# Altium project basestation_0v1.PrjPCB
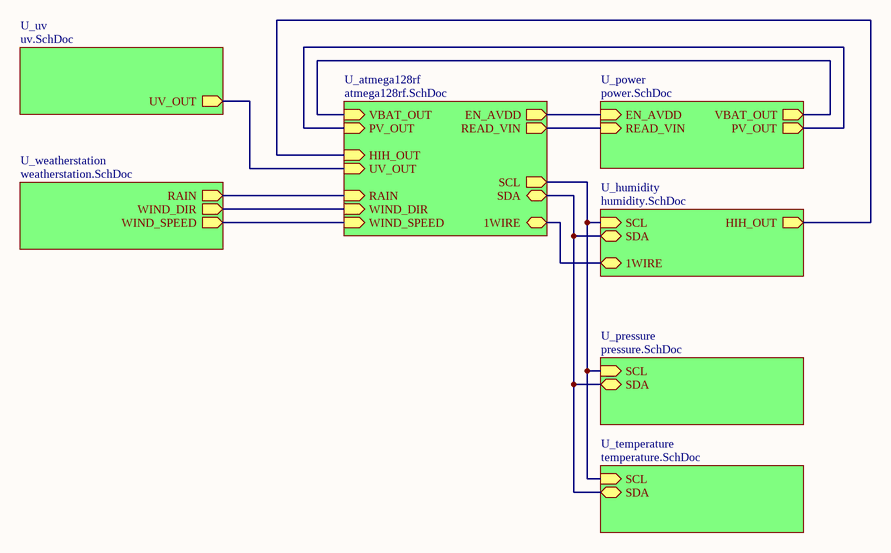
[diagram p0: main.SchDoc]
8 sheets, 134 parts. Net scope: hierarchical (ports join the sheet entries above them; power ports are global).
Board file: basestation_0v1.PcbDoc
Sheets:
  main.SchDoc
    U_atmega128rf = atmega128rf.SchDoc
    U_humidity = humidity.SchDoc
    U_power = power.SchDoc
    U_pressure = pressure.SchDoc
    U_temperature = temperature.SchDoc
    U_uv = uv.SchDoc
    U_weatherstation = weatherstation.SchDoc

## Sheet main.SchDoc: Main
size A4; CheckedBy: rrodrigu; Author: Satxo; CompanyName: Satxo; Revision: 0v1; SheetNumber: 1; SheetTotal: 8; ProjectName: Basestation

### Sub-sheets
U_atmega128rf = atmega128rf.SchDoc: SCL (out), SDA (bidir), HIH_OUT (in), PV_OUT (in), UV_OUT (in), VBAT_OUT (in), RAIN (in), WIND_DIR (in), WIND_SPEED (in), EN_AVDD (out), READ_VIN (out), 1WIRE (bidir)
U_humidity = humidity.SchDoc: HIH_OUT (out), SCL (in), SDA (bidir), 1WIRE (bidir)
U_power = power.SchDoc: PV_OUT (out), EN_AVDD (in), VBAT_OUT (out), READ_VIN (in)
U_pressure = pressure.SchDoc: SCL (in), SDA (bidir)
U_temperature = temperature.SchDoc: SCL (in), SDA (bidir)
U_uv = uv.SchDoc: UV_OUT (out)
U_weatherstation = weatherstation.SchDoc: RAIN (out), WIND_DIR (out), WIND_SPEED (out)

### Nets
1WIRE: sheet U_atmega128rf/1WIRE, sheet U_humidity/1WIRE
EN_AVDD: sheet U_atmega128rf/EN_AVDD, sheet U_power/EN_AVDD
HIH_OUT: sheet U_atmega128rf/HIH_OUT, sheet U_humidity/HIH_OUT
PV_OUT: sheet U_atmega128rf/PV_OUT, sheet U_power/PV_OUT
RAIN: sheet U_atmega128rf/RAIN, sheet U_weatherstation/RAIN
READ_VIN: sheet U_atmega128rf/READ_VIN, sheet U_power/READ_VIN
SCL: sheet U_atmega128rf/SCL, sheet U_humidity/SCL, sheet U_pressure/SCL, sheet U_temperature/SCL
SDA: sheet U_atmega128rf/SDA, sheet U_humidity/SDA, sheet U_pressure/SDA, sheet U_temperature/SDA
UV_OUT: sheet U_atmega128rf/UV_OUT, sheet U_uv/UV_OUT
VBAT_OUT: sheet U_atmega128rf/VBAT_OUT, sheet U_power/VBAT_OUT
WIND_DIR: sheet U_atmega128rf/WIND_DIR, sheet U_weatherstation/WIND_DIR
WIND_SPEED: sheet U_atmega128rf/WIND_SPEED, sheet U_weatherstation/WIND_SPEED

### Notes on the sheet
- Title
- Size:
- Date:
- A4
- Number:
- Time:
- Revision:
- Sheet
- of
- File:

## Sheet atmega128rf.SchDoc: Microcontroller
size A3; CheckedBy: rrodrigu; Author: Satxo; CompanyName: Satxo; Revision: 0v1; SheetNumber: 3; SheetTotal: 8; ProjectName: Basesation
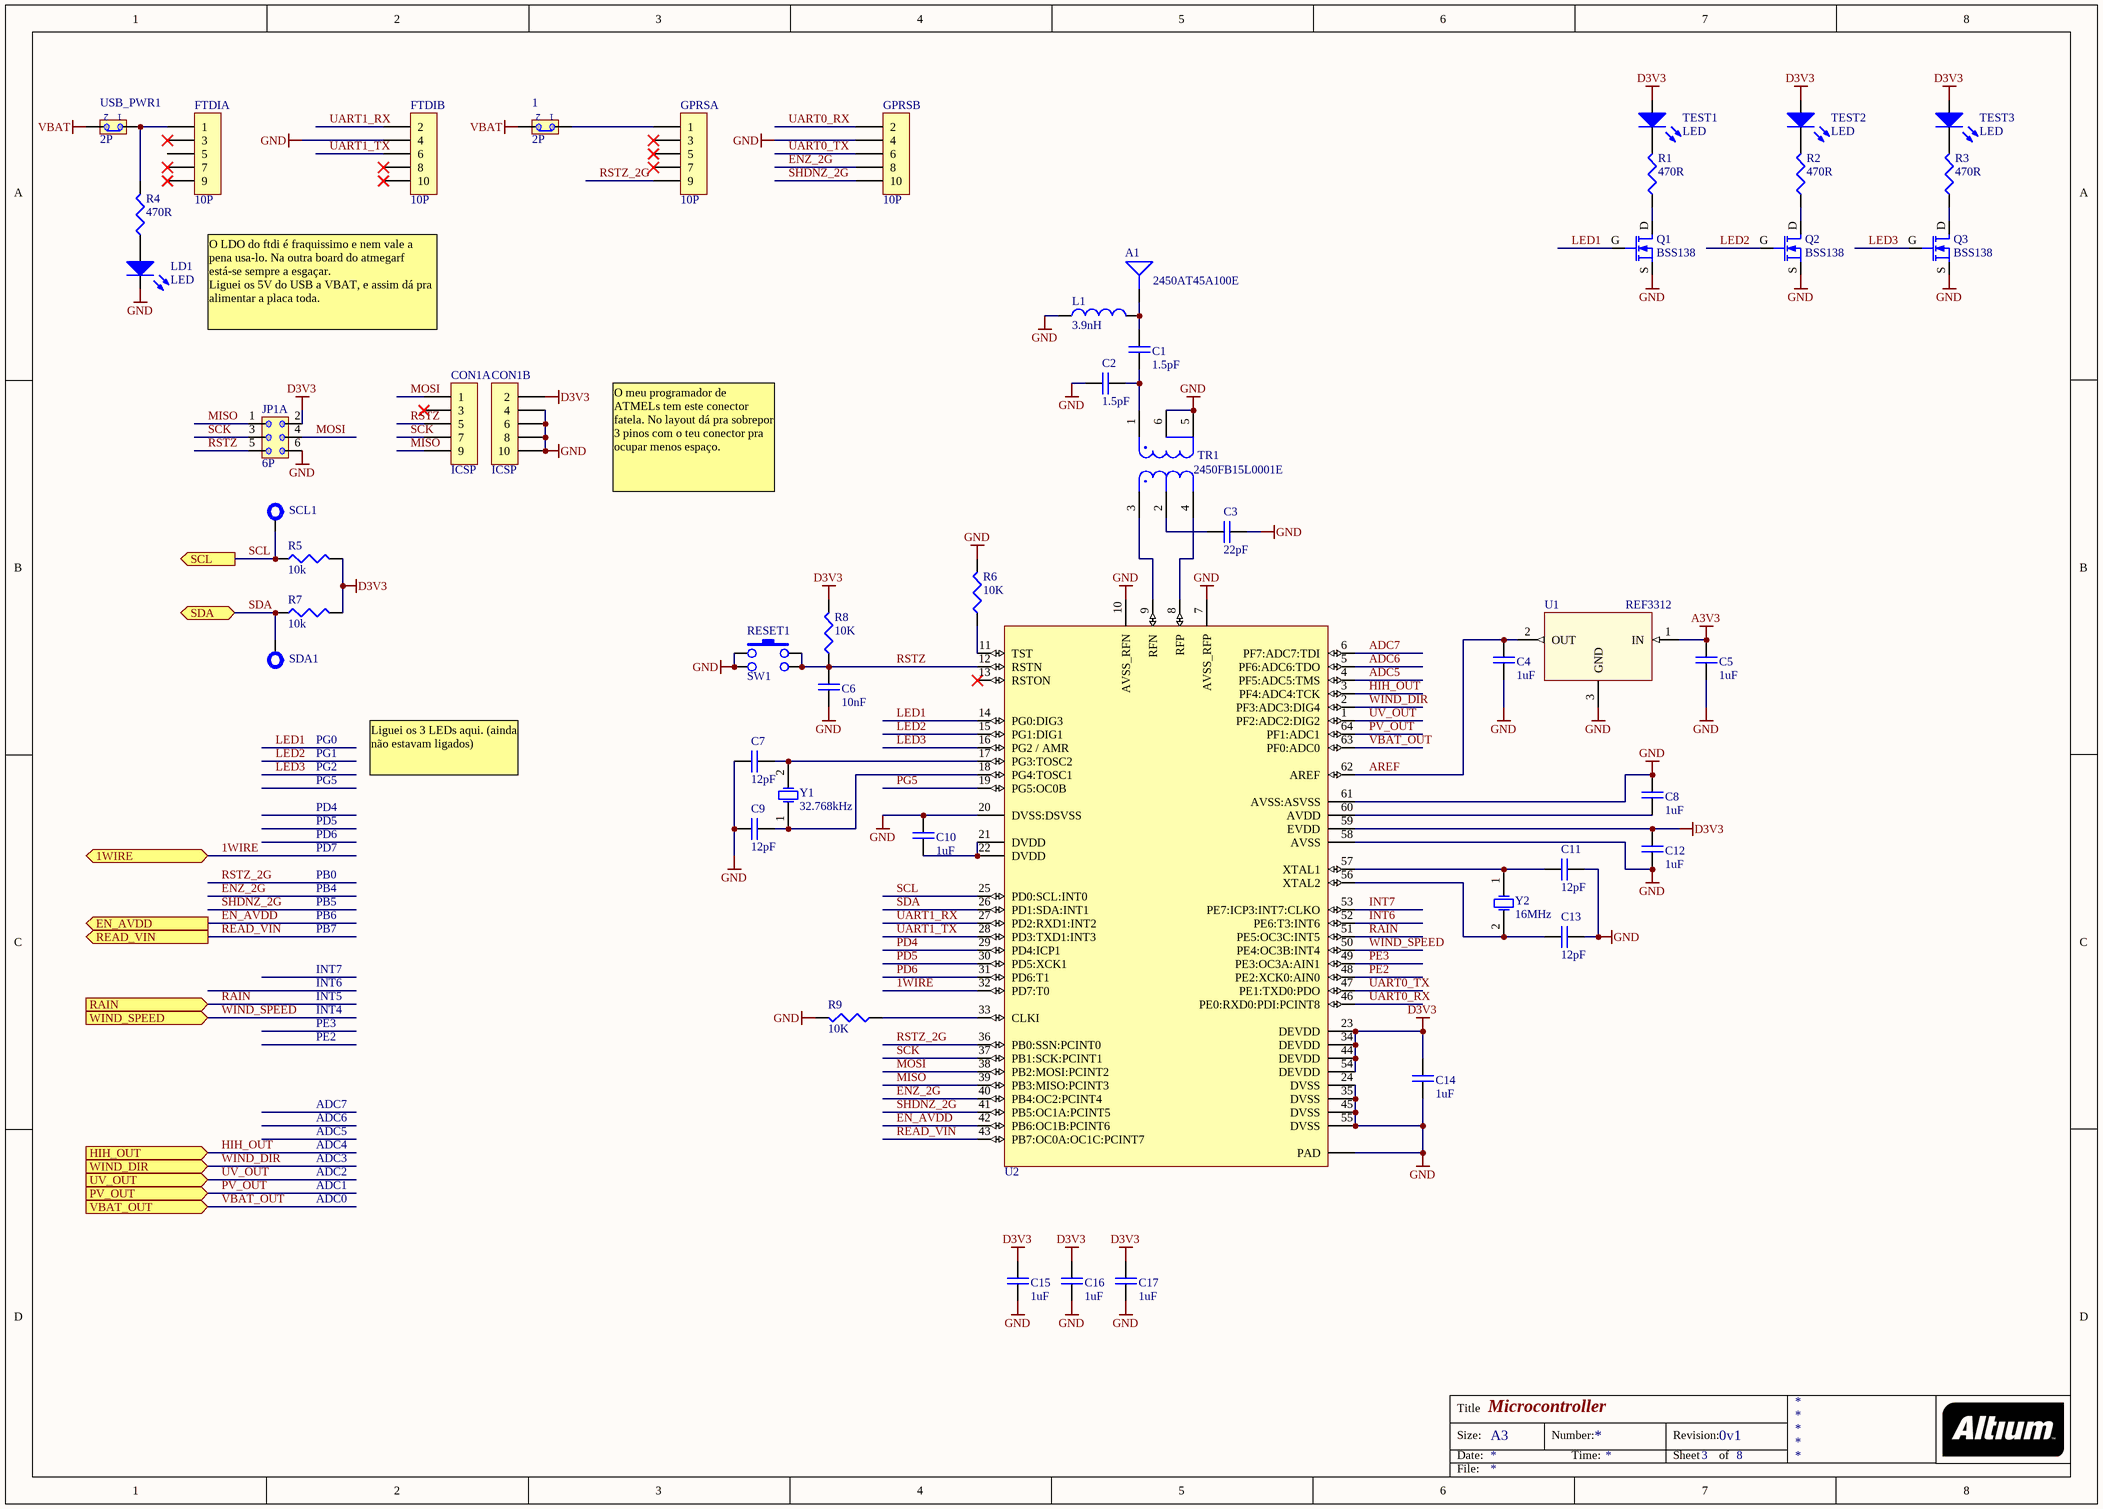
[diagram p1: atmega128rf.SchDoc]

### Parts
(Parts that share a designator on the sheet are numbered #1, #2 ... from top to bottom, then left to right.)
1  2P  [SIP-2]
A1  2450AT45A100E  [2450AT45A100E]
C1#1  1.5pF  [0402]
C2#1  1.5pF  [0402]
C3#1  22pF  [0402]
C4#1  1uF  [0603]
C5#1  1uF  [0603]
C6#1  10nF  [0603]
C7#1  12pF  [0603]
C8#1  1uF  [0603]
C9#1  12pF  [0603]
C10  1uF  [0603]
C11  12pF  [0603]
C12  1uF  [0603]
C13  12pF  [0603]
C14  1uF  [0603]
C15  1uF  [0603]
C16  1uF  [0603]
C17  1uF  [0603]
CON1#1  ICSP  [IDC-10-F]  (parts A,B of 2)
FTDI  10P  [IDC-10-90]  (parts A,B of 2)
GPRS  10P  [IDC-10-90]  (parts A,B of 2)
JP1#1  6P  [DIL-6]  (part A of 3)
L1  3.9nH  [0402]
LD1  LED  [0805@DIODE]
Q1#1  BSS138  [SOT-23@GSD]
Q2#1  BSS138  [SOT-23@GSD]
Q3  BSS138  [SOT-23@GSD]
R1#1  470R  [0603]
R2#1  470R  [0603]
R3#1  470R  [0603]
R4#1  470R  [0603]
R5#1  10k  [0603]
R6#1  10K  [0603]
R7#1  10k  [0603]
R8#1  10K  [0603]
R9#1  10K  [0603]
RESET1  SW1  [MICROSWITCH]
SCL1  Test Point  [TERMINAL]  (value not drawn)  (no BOM)
SDA1  Test Point  [TERMINAL]  (value not drawn)  (no BOM)
TEST1  LED  [0805@DIODE]
TEST2  LED  [0805@DIODE]
TEST3  LED  [0805@DIODE]
TR1  2450FB15L0001E  [0805@BALUN]
U1#1  REF3312  [SOT-23]
U2#1  ATmega128RFA1  [QFN-64@EP]  (value not drawn)
USB_PWR1  2P  [SIP-2]
Y1  32.768kHz  [HC-49U]
Y2  16MHz  [HC-49U]

### Ports
1WIRE (bidir), EN_AVDD (out), HIH_OUT (in), PV_OUT (in), RAIN (in), READ_VIN (out), SCL (out), SDA (bidir), UV_OUT (in), VBAT_OUT (in), WIND_DIR (in), WIND_SPEED (in)

### Nets
A3V3: C5#1.1 U1#1.1(IN)
D3V3: C12.2 C14.2 C15.2 C16.2 C17.2 CON1#1.2 JP1#1.2 R5#1.2 R7#1.2 R8#1.2 TEST1.A TEST2.A TEST3.A U2#1.23(DEVDD) U2#1.34(DEVDD) U2#1.44(DEVDD) U2#1.54(DEVDD) U2#1.59(EVDD)
GND: C2#1.1 C3#1.2 C4#1.2 C5#1.2 C6#1.2 C7#1.1 C8#1.2 C9#1.1 C10.2 C11.2 C12.1 C13.2 C14.1 C15.1 C16.1 C17.1 CON1#1.4 CON1#1.6 CON1#1.8 CON1#1.10 FTDI.4 GPRS.4 JP1#1.6 L1.1 LD1.K Q1#1.S Q2#1.S Q3.S R6#1.2 R9#1.2 RESET1.1 RESET1.3 TR1.5(Ground) TR1.6(Ground) U1#1.3(GND) U2#1.7(AVSS_RFP) U2#1.10(AVSS_RFN) U2#1.20(DVSS:DSVSS) U2#1.24(DVSS) U2#1.35(DVSS) U2#1.45(DVSS) U2#1.55(DVSS) U2#1.58(AVSS) U2#1.61(AVSS:ASVSS) U2#1.PAD
VBAT: 1.2 USB_PWR1.2
1WIRE: U2#1.32(PD7:T0) ; port 1WIRE
ADC5: U2#1.4(PF5:ADC5:TMS)
ADC6: U2#1.5(PF6:ADC6:TDO)
ADC7: U2#1.6(PF7:ADC7:TDI)
AREF: C4#1.1 U1#1.2(OUT) U2#1.62(AREF)
EN_AVDD: U2#1.42(PB6:OC1B:PCINT6) ; port EN_AVDD
ENZ_2G: GPRS.8 U2#1.40(PB4:OC2:PCINT4)
HIH_OUT: U2#1.3(PF4:ADC4:TCK) ; port HIH_OUT
INT6: U2#1.52(PE6:T3:INT6)
INT7: U2#1.53(PE7:ICP3:INT7:CLKO)
LED1: Q1#1.G U2#1.14(PG0:DIG3)
LED2: Q2#1.G U2#1.15(PG1:DIG1)
LED3: Q3.G U2#1.16(PG2_/_AMR)
MISO: CON1#1.9 JP1#1.1 U2#1.39(PB3:MISO:PCINT3)
MOSI: CON1#1.1 JP1#1.4 U2#1.38(PB2:MOSI:PCINT2)
PD4: U2#1.29(PD4:ICP1)
PD5: U2#1.30(PD5:XCK1)
PD6: U2#1.31(PD6:T1)
PE2: U2#1.48(PE2:XCK0:AIN0)
PE3: U2#1.49(PE3:OC3A:AIN1)
PG5: U2#1.19(PG5:OC0B)
PV_OUT: U2#1.64(PF1:ADC1) ; port PV_OUT
RAIN: U2#1.51(PE5:OC3C:INT5) ; port RAIN
READ_VIN: U2#1.43(PB7:OC0A:OC1C:PCINT7) ; port READ_VIN
RSTZ: C6#1.1 CON1#1.5 JP1#1.5 R8#1.1 RESET1.2 RESET1.4 U2#1.12(RSTN)
RSTZ_2G: GPRS.9 U2#1.36(PB0:SSN:PCINT0)
SCK: CON1#1.7 JP1#1.3 U2#1.37(PB1:SCK:PCINT1)
SCL: R5#1.1 SCL1.1(TP) U2#1.25(PD0:SCL:INT0) ; port SCL
SDA: R7#1.1 SDA1.1(TP) U2#1.26(PD1:SDA:INT1) ; port SDA
SHDNZ_2G: GPRS.10 U2#1.41(PB5:OC1A:PCINT5)
UART0_RX: GPRS.2 U2#1.46(PE0:RXD0:PDI:PCINT8)
UART0_TX: GPRS.6 U2#1.47(PE1:TXD0:PDO)
UART1_RX: FTDI.2 U2#1.27(PD2:RXD1:INT2)
UART1_TX: FTDI.6 U2#1.28(PD3:TXD1:INT3)
UV_OUT: U2#1.1(PF2:ADC2:DIG2) ; port UV_OUT
VBAT_OUT: U2#1.63(PF0:ADC0) ; port VBAT_OUT
WIND_DIR: U2#1.2(PF3:ADC3:DIG4) ; port WIND_DIR
WIND_SPEED: U2#1.50(PE4:OC3B:INT4) ; port WIND_SPEED
Net1_1: 1.1 GPRS.1
NetA1_1: A1.1 C1#1.2 L1.2
NetC1#1_1: C1#1.1 C2#1.2 TR1.1(Unbalanced_Port)
NetC3#1_1: C3#1.1 TR1.2(DC_Feed_+_RF_GND)
NetC7#1_2: C7#1.2 U2#1.17(PG3:TOSC2) Y1.2(OSC2)
NetC8#1_1: C8#1.1 U2#1.60(AVDD)
NetC9#1_2: C9#1.2 U2#1.18(PG4:TOSC1) Y1.1(OSC1)
NetC10_1: C10.1 U2#1.21(DVDD) U2#1.22(DVDD)
NetC11_1: C11.1 U2#1.57(XTAL1) Y2.1(OSC1)
NetC13_1: C13.1 U2#1.56(XTAL2) Y2.2(OSC2)
NetFTDI_1: FTDI.1 R4#1.2 USB_PWR1.1
NetLD1_A: LD1.A R4#1.1
NetQ1#1_D: Q1#1.D R1#1.1
NetQ2#1_D: Q2#1.D R2#1.1
NetQ3_D: Q3.D R3#1.1
NetR1#1_2: R1#1.2 TEST1.K
NetR2#1_2: R2#1.2 TEST2.K
NetR3#1_2: R3#1.2 TEST3.K
NetR6#1_1: R6#1.1 U2#1.11(TST)
NetR9#1_1: R9#1.1 U2#1.33(CLKI)
NetTR1_3: TR1.3(Balanced_Port) U2#1.9(RFN)
NetTR1_4: TR1.4(Balanced_Port) U2#1.8(RFP)

Not connected (* = marked no-connect by the designer): CON1#1 3*; FTDI 3* 5 7* 8* 9* 10*; GPRS 3* 5* 7*; U2#1 13(RSTON)*

### Notes on the sheet
- O LDO do ftdi é fraquissimo e nem vale a pena usa-lo. Na outra board do atmegarf está-se sempre a esgaçar.
  Liguei os 5V do USB a VBAT, e assim dá pra alimentar a placa toda.
- O meu programador de ATMELs tem este conector fatela. No layout dá pra sobrepor 3 pinos com o teu conector pra ocupar menos espaço.
- PG0
- PG1
- PG2
- PG5
- Liguei os 3 LEDs aqui. (ainda não estavam ligados)
- PD4
- PD5
- PD6
- PD7
- PB0
- PB4
- PB5
- PB6
- INT6
- INT7
- PB7
- PE2
- PE3
- INT4
- INT5
- ADC6
- ADC7
- ADC1
- ADC2
- ADC3
- ADC4
- ADC5
- ADC0
- Title
- Size:
- Date:
- A3
- Number:
- Time:
- Revision:
- Sheet
- of
- File:

### Library data of the parts
1 USB_PWR1 = JMP2: 2-pin Jumper; Owner: Nuno Brum; Sub-Type: Connector; STATE1: 1; Assembly: INS; Validation Date: 2006-05-15; Creation Date: 2002-07-17; Status: Valid; Type: Electrical & Mechanical
A1 = Antenna SE: ANTENNA
C1#1 C2#1 C3#1 C4#1 C5#1 C6#1 C7#1 C8#1 C9#1 C10-C17 = CAP: Capacitor; Owner: Nuno Brum; Sub-Type: Ceramic; Assembly: INS; Maximum Voltage: *; Creation Date: 2005-04-28; Status: Valid; Validation date: 2006-05-15; Type: Capacitor
CON1#1 FTDI GPRS = CON10: Connector 10 Pins; Owner: António Silva; Assembly: INS; Sub-Type: Connector; Creation Date: 2005-11-21; Status: Valid; Validation Date: 2006-05-15; Type: Electrical & Mechanical
JP1#1 = JMP6: 6-Pin Jumper; Sub-Type: Connector; Owner: Rui Rebelo; Assembly: INS; Creation Date: 2005-07-17; Status: Valid; Validation Date: 2006-05-15; Type: Electrical & Mechanical
L1 = IND: Inductor; Owner: Nuno Brum; Sub-Type: Generic; Assembly: INS; Validation date: 2006-05-15; Creation Date: 2002-07-17; Status: Valid; Type: Inductor
LD1 TEST1-TEST3 = LED: Light emitting diode; Owner: Nuno Brum; Assembly: INS; Creation Date: 2001-06-05; Sub-Type: LED; Status: Valid; Validation date: 2006-05-15; Model: LED; Type: Diode
Q1#1 Q2#1 Q3 = MOSFET-N: N-Channel Logic Level Enhancement Mode Field Effect Transistor; pin to pad: 2>3 3>2; Owner: Nuno Brum; Sub-Type: MOSFET; Assembly: INS; Creation Date: 2001-06-05; Status: Valid; Model: BSS138; Type: Transistor
R1#1 R2#1 R3#1 R4#1 R5#1 R6#1 R7#1 R8#1 R9#1 = RES: Resistor; Owner: Nuno Brum; Sub-Type: Generic; Assembly: INS; Validation date: 2006-05-15; Creation Date: 2002-07-17; Status: Valid; Power: *; Type: Resistor
RESET1 = SW1: Switch Push Button; Owner: Nuno Brum; Assembly: INS; Validation Date: 2006-05-15; Sub-Type: Switch; Creation Date: 2002-07-17; Status: Valid; Type: Electrical & Mechanical
SCL1 SDA1 = TEST-PROBE: Test/Probe Point; Owner: Nuno Brum; Sub-Type: Mechanical; Assembly: PCB; Validation Date: 2006-05-15; Type: PCB; Creation Date: 2005-06-01; Status: Valid
TR1 = 2450FB15L0001E: FILTER BALUN ATMEL 2.45GHZ; Owner: Rui Rebelo; Sub-Type: Transformer; Type: Electrical & Mechanical; Assembly: INS; Creation Date: 2002-07-25; Status: New
U1#1 = REF3312: Voltage Reference 1.25V, 30ppm/degC, 5mA; Type: IC; Creation Date: 2012-12-09
U2#1 = ATmega128RFA1: 802.15.4 compliant AVR transceiver; verified by: vlarsen; verified date: 2010-12-05; Status: Verified
Y1 Y2 = Crystal Oscillator: Published: 17-Jul-2002; DatasheetDocument: 18-Apr-2000; PackageReference: CSM-7; Publisher: Altium Limited; ComponentLink1Description: Manufacturer Link; ComponentLink1URL: http://www.ecsxtal.com/; ComponentLink2Description: Datasheet; ComponentLink2URL: http://www.ecsxtal.com/pdf3/CSM_7.pdf

## Sheet humidity.SchDoc
size A4
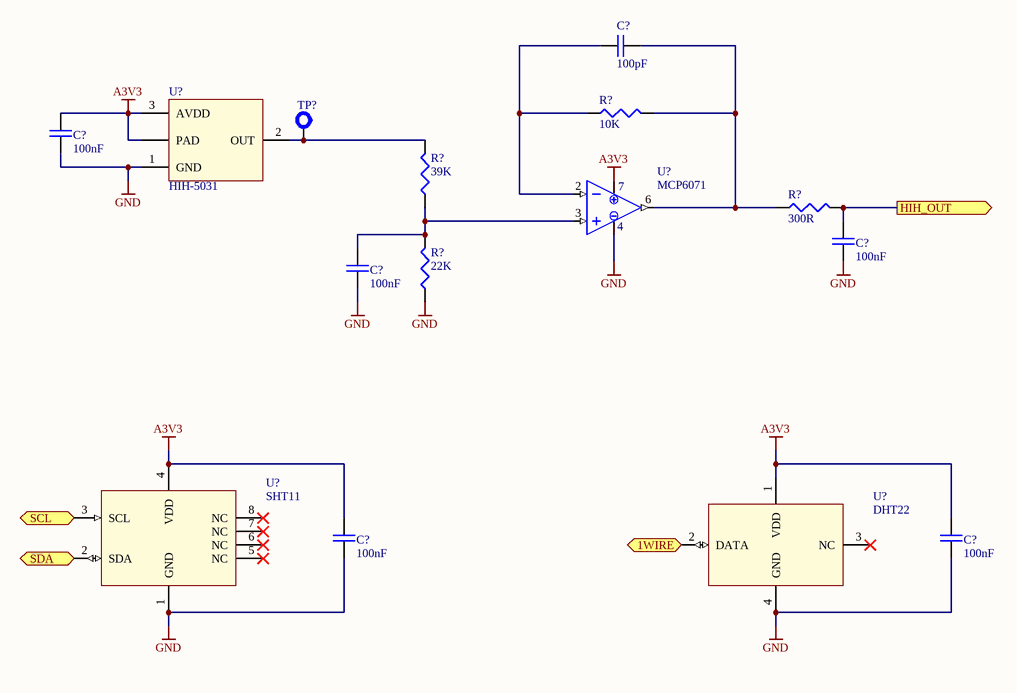
[diagram p2: humidity.SchDoc]

### Parts
C27  100pF  [0603]
C28  100nF  [0603]
C29  100nF  [0603]
C30  100nF  [0603]
C31  100nF  [0603]
C32  100nF  [0603]
R22  10K  [0603]
R24  39K  [0603]
R25  300R  [0603]
R26  22K  [0603]
TP1  Test Point  [TERMINAL]  (value not drawn)  (no BOM)
U7  HIH-5031  [HIH]
U8  MCP6071  [SOIC-8]
U10  DHT22  [DHT22]
U?  SHT11  [SHT11]

### Ports
1WIRE (bidir), HIH_OUT (out), SCL (in), SDA (bidir)

### Nets
A3V3: C28.2 C31.2 C32.2 U7.3(AVDD) U7.PAD U8.7(VDD) U10.1(VDD) U?.4(VDD)
GND: C28.1 C29.1 C30.1 C31.1 C32.1 R26.1 U7.1(GND) U8.4(VSS) U10.4(GND) U?.1(GND)
1WIRE: U10.2(DATA) ; port 1WIRE
HIH_OUT: C29.2 R25.2 ; port HIH_OUT
SCL: U?.3(SCL) ; port SCL
SDA: U?.2(SDA) ; port SDA
NetC27_1: C27.1 R22.1 U8.2(INN)
NetC27_2: C27.2 R22.2 R25.1 U8.6(VOUT)
NetC30_2: C30.2 R24.1 R26.2 U8.3(INP)
NetR24_2: R24.2 TP1.1(TP) U7.2(OUT)

Not connected (* = marked no-connect by the designer): U10 3(NC)*; U? 5(NC)* 6(NC)* 7(NC)* 8(NC)*

### Notes on the sheet
- Title
- Size:
- Date:
- A4
- Number:
- Time:
- Revision:
- Sheet
- of
- File:

### Library data of the parts
C27-C32 = CAP: as C1#1 on sheet atmega128rf; Maximum Voltage: *; Creation Date: 2005-04-28; Status: Valid; Validation date: 2006-05-15; Type: Capacitor
R22 R24-R26 = RES: as R1#1 on sheet atmega128rf; Validation date: 2006-05-15; Creation Date: 2002-07-17; Status: Valid; Power: *; Type: Resistor
TP1 = TEST-PROBE: as SCL1 on sheet atmega128rf; Validation Date: 2006-05-15; Type: PCB; Creation Date: 2005-06-01; Status: Valid
U7 = HIH-5031: Low Voltage Humidity Sensor; Type: IC; Creation Date: 2012-03-05
U8 = MCP6V26: Low-Offset Opamp; Type: IC; Creation Date: 2012-03-15
U10 = DHT22: Digital Humidity and Temperature Sensor; Type: IC; Creation Date: 2012-12-08
U? = SHT11: Digital Humidity and Temperature Sensor; Type: IC; Creation Date: 2012-12-09

## Sheet power.SchDoc: Power
size A4; CheckedBy: rrodrigu; Author: Satxo; CompanyName: Satxo; Revision: 0v1; SheetNumber: 2; SheetTotal: 8; ProjectName: Basestation
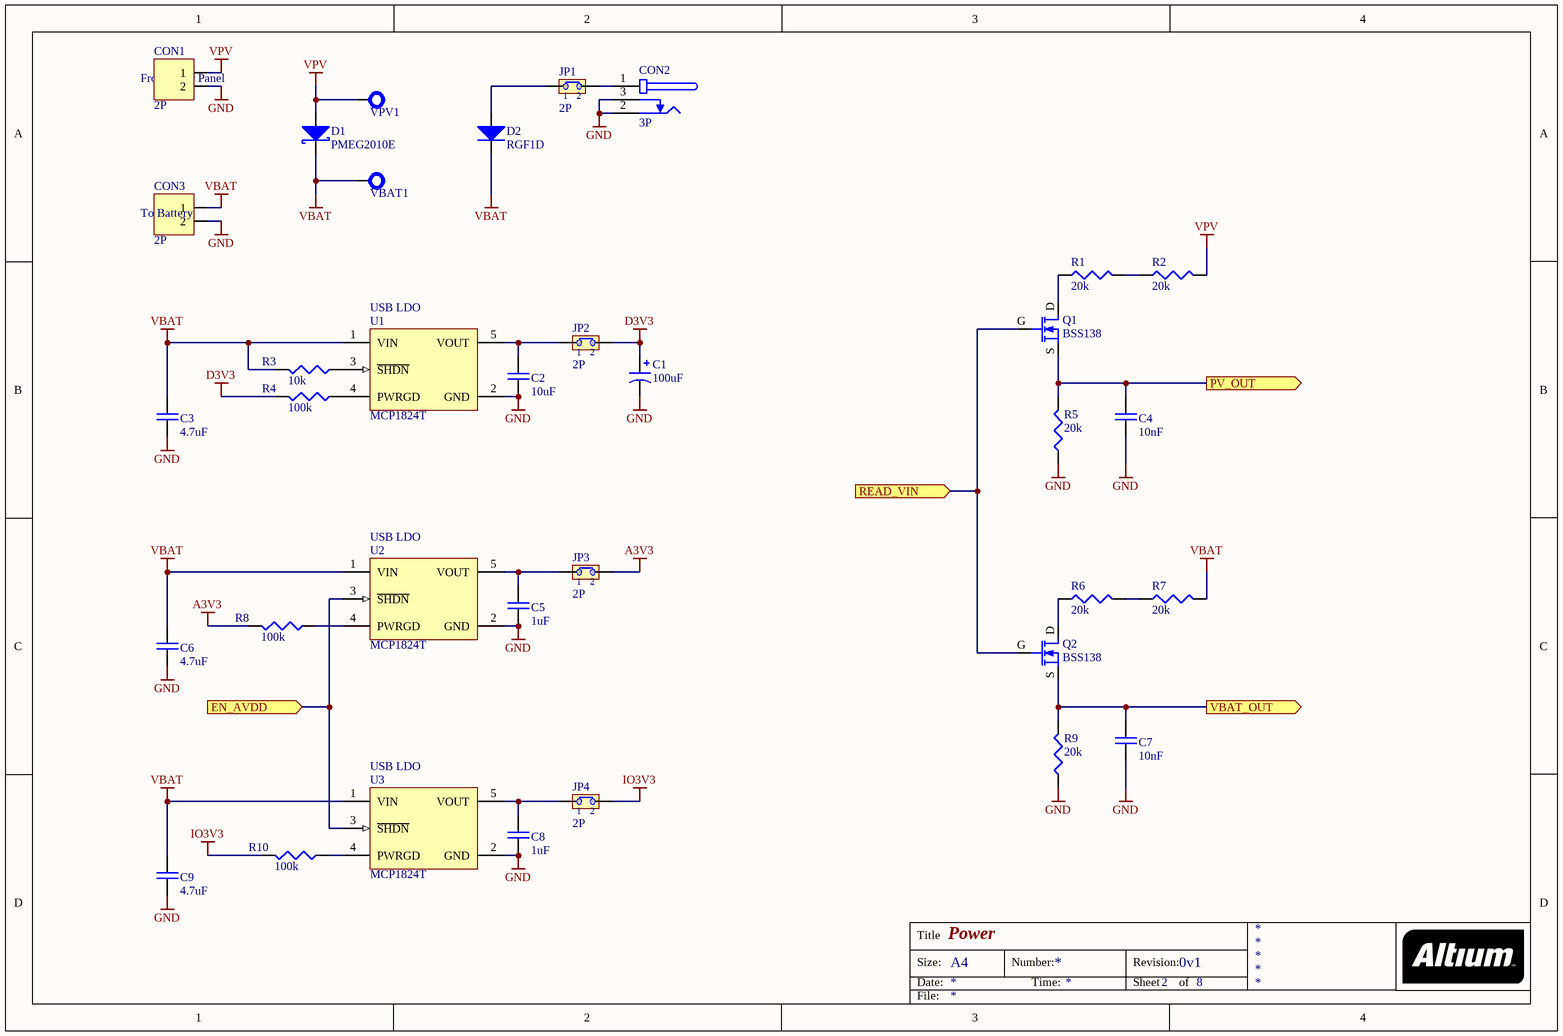
[diagram p3: power.SchDoc]

### Parts
(Parts that share a designator on the sheet are numbered #1, #2 ... from top to bottom, then left to right.)
C1#2  100uF  [RADIAL-2.5MM]
C2#2  10uF  [0805]
C3#2  4.7uF  [0805]
C4#2  10nF  [0603]
C5#2  1uF  [0805]
C6#2  4.7uF  [0805]
C7#2  10nF  [0603]
C8#2  1uF  [0805]
C9#2  4.7uF  [0805]
CON1#2  2P  [JST-2MM]
CON2  3P  [JACKPOW/PD-2.5MM-TH]
CON3  2P  [INTERLOCK2-5MM-FIXED]
D1  PMEG2010E  [SOD-123]
D2#1  RGF1D  [DO-214BA]
JP1#2  2P  [SIP-2]
JP2  2P  [SIP-2]
JP3  2P  [SIP-2]
JP4  2P  [SIP-2]
Q1#2  BSS138  [SOT-23@GSD]
Q2#2  BSS138  [SOT-23@GSD]
R1#2  20k  [0603]
R2#2  20k  [0603]
R3#2  10k  [0603]
R4#2  100k  [0603]
R5#2  20k  [0603]
R6#2  20k  [0603]
R7#2  20k  [0603]
R8#2  100k  [0603]
R9#2  20k  [0603]
R10  100k  [0603]
U1#2  MCP1824T  [SOT-23-5]
U2#2  MCP1824T  [SOT-23-5]
U3  MCP1824T  [SOT-23-5]
VBAT1  Test Point  [TERMINAL]  (value not drawn)  (no BOM)
VPV1  Test Point  [TERMINAL]  (value not drawn)  (no BOM)

### Ports
EN_AVDD (in), PV_OUT (out), READ_VIN (in), VBAT_OUT (out)

### Nets
A3V3: JP3.2 R8#2.2
D3V3: C1#2.1(P) JP2.2 R4#2.2
GND: C1#2.2(N) C2#2.1 C3#2.1 C4#2.1 C5#2.1 C6#2.1 C7#2.1 C8#2.1 C9#2.1 CON1#2.2 CON2.2 CON2.3 CON3.2 R5#2.1 R9#2.1 U1#2.2(GND) U2#2.2(GND) U3.2(GND)
IO3V3: JP4.2 R10.2
VBAT: C3#2.2 C6#2.2 C9#2.2 CON3.1 D1.K D2#1.K R3#2.2 R7#2.2 U1#2.1(VIN) U2#2.1(VIN) U3.1(VIN) VBAT1.1(TP)
VPV: CON1#2.1 D1.A R2#2.2 VPV1.1(TP)
EN_AVDD: U2#2.3(~{SHDN}) U3.3(~{SHDN}) ; port EN_AVDD
PV_OUT: C4#2.2 Q1#2.S R5#2.2 ; port PV_OUT
READ_VIN: Q1#2.G Q2#2.G ; port READ_VIN
VBAT_OUT: C7#2.2 Q2#2.S R9#2.2 ; port VBAT_OUT
NetC2#2_2: C2#2.2 JP2.1 U1#2.5(VOUT)
NetC5#2_2: C5#2.2 JP3.1 U2#2.5(VOUT)
NetC8#2_2: C8#2.2 JP4.1 U3.5(VOUT)
NetCON2_1: CON2.1 JP1#2.2
NetD2#1_A: D2#1.A JP1#2.1
NetQ1#2_D: Q1#2.D R1#2.1
NetQ2#2_D: Q2#2.D R6#2.1
NetR1#2_2: R1#2.2 R2#2.1
NetR3#2_1: R3#2.1 U1#2.3(~{SHDN})
NetR4#2_1: R4#2.1 U1#2.4(PWRGD)
NetR6#2_2: R6#2.2 R7#2.1
NetR8#2_1: R8#2.1 U2#2.4(PWRGD)
NetR10_1: R10.1 U3.4(PWRGD)

### Notes on the sheet
- From Solar Panel
- To Battery
- (near U1#2) USB LDO
- (near U2#2) USB LDO
- (near U3) USB LDO
- Title
- Size:
- Date:
- A4
- Number:
- Time:
- Revision:
- Sheet
- of
- File:

### Library data of the parts
C1#2 = CAP POL: Polarized Capacitor; Owner: Nuno Brum; Sub-Type: Tantalum; Assembly: INS; Validation date: 2006-05-15; Creation Date: 2005-04-28; Status: Valid; Type: Capacitor
C2#2 C3#2 C4#2 C5#2 C6#2 C7#2 C8#2 C9#2 = CAP: as C1#1 on sheet atmega128rf; Maximum Voltage: *; Creation Date: 2005-04-28; Status: Valid; Validation date: 2006-05-15; Type: Capacitor
CON1#2 CON3 = CON02: Connector 2 pins; Owner: Rui Rebelo; Assembly: INS; Sub-Type: Connector; Creation Date: 2005-05-27; Status: Valid; Validation Date: 2006-05-15; Type: Electrical & Mechanical
CON2 = JACK POWER PD: Jack Power with insertion detect; Sub-Type: Connector; Owner: Gonçalo Costa; Assembly: INS; Creation Date: 2005-12-05; Status: New; Type: Electrical & Mechanical
D1 = Diode Schottky: Small Signal Schottky Diode; Owner: Nuno Brum; Assembly: INS; Validation date: 2006-05-15; Creation Date: 2001-06-05; Sub-Type: Schottky; Status: Valid; Model: PMEG2010E; Type: Diode
D2#1 = Diode: Vishay Standard Avalanche Sinterglass Diode; Owner: Nuno Brum; Sub-Type: Generic; Assembly: INS; Validation date: 2006-05-15; Creation Date: 2001-06-05; Status: Valid; Model: RGF1D; Type: Diode
JP1#2 JP2-JP4 = JMP2: as 1 on sheet atmega128rf; Validation Date: 2006-05-15; Creation Date: 2002-07-17; Status: Valid; Type: Electrical & Mechanical
Q1#2 Q2#2 = MOSFET-N: N-Channel Logic Level Enhancement Mode Field Effect Transistor; pin to pad: 2>3 3>2; Owner: Nuno Brum; Sub-Type: MOSFET; Assembly: INS; Creation Date: 2001-06-05; Status: Valid; Model: BSS138; Type: Transistor
R1#2 R2#2 R3#2 R4#2 R5#2 R6#2 R7#2 R8#2 R9#2 R10 = RES: as R1#1 on sheet atmega128rf; Validation date: 2006-05-15; Creation Date: 2002-07-17; Status: Valid; Power: *; Type: Resistor
U1#2 U2#2 U3 = MCP1824T: 300 mA, Low Voltage, Low Quiescent Current LDO Regulator, 5-Pin SOT-23, Extended Temperature, Tape and Reel; Published: 29-Jan-2009; DatasheetVersion: revA, Aug-2007; PackageVersion: revBB, Aug-2009; PackageReference: SOT-23-OT5; Publisher: Altium Limited; PackageDescription: 5-Lead Plastic Small Outline Transistor (OT) [SOT-23]; Supplier 1: Digi-Key; Supplier Part Number 1: MCP1824T-3302E/OTTR-ND; Supplier 2: Digi-Key; Supplier Part Number 2: MCP1824T-3302E/OTCT-ND; Supplier 3: Digi-Key; Supplier Part Number 3: MCP1824T-3302E/OTDKR-ND; Supplier 4: Farnell; Supplier Part Number 4: 1578387; Code_IPC: SOT23-5; ComponentLink1Description: Datasheet; ComponentLink1URL: http://ww1.microchip.com/downloads/en/DeviceDoc/22070a.pdf; ComponentLink2Description: Packaging Specification; ComponentLink2URL: http://www.microchip.com/stellent/groups/techpub_sg/documents/packagingspec/en012702.pdf; ComponentLink3Description: Microchip.com Home; ComponentLink3URL: http://www.microchip.com/
VBAT1 VPV1 = TEST-PROBE: as SCL1 on sheet atmega128rf; Validation Date: 2006-05-15; Type: PCB; Creation Date: 2005-06-01; Status: Valid

## Sheet pressure.SchDoc: Pressure Sensor
size A4; CheckedBy: rrodrigu; Author: Satxo; CompanyName: Satxo; Revision: 0v1; SheetNumber: 5; SheetTotal: 8; ProjectName: Basestation
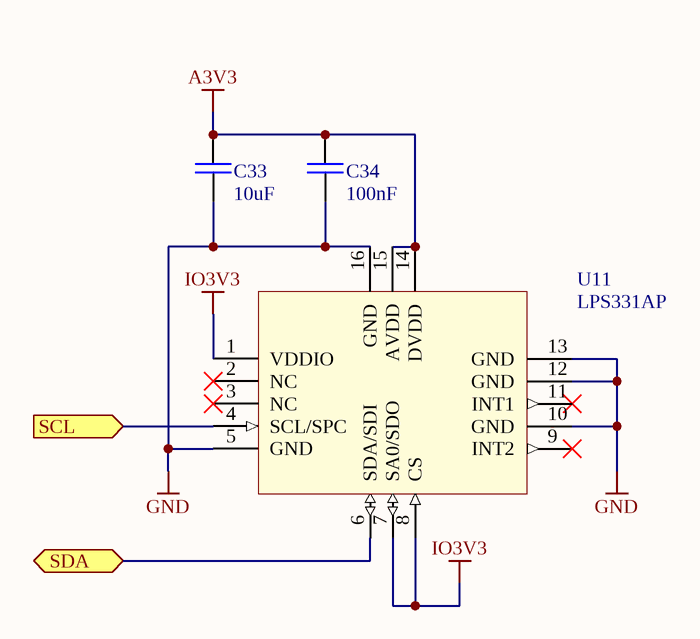
[diagram p4: pressure.SchDoc]

### Parts
C33  10uF  [0805]
C34  100nF  [0603]
U11  LPS331AP  [HCLGA-16]

### Ports
SCL (in), SDA (bidir)

### Nets
A3V3: C33.2 C34.2 U11.14(DVDD) U11.15(AVDD)
GND: C33.1 C34.1 U11.5(GND) U11.10(GND) U11.12(GND) U11.13(GND) U11.16(GND)
IO3V3: U11.1(VDDIO) U11.7(SA0/SDO) U11.8(CS)
SCL: U11.4(SCL/SPC) ; port SCL
SDA: U11.6(SDA/SDI) ; port SDA

Not connected (* = marked no-connect by the designer): U11 2(NC)* 3(NC)* 9(INT2)* 11(INT1)*

### Notes on the sheet
- Title
- Size:
- Date:
- A4
- Number:
- Time:
- Revision:
- Sheet
- of
- File:

### Library data of the parts
C33 C34 = CAP: as C1#1 on sheet atmega128rf; Maximum Voltage: *; Creation Date: 2005-04-28; Status: Valid; Validation date: 2006-05-15; Type: Capacitor
U11 = LPS331AP: Pressure sensor, 260 - 1260 mbar; Creation Date: 2012-12-06; Type: IC

## Sheet temperature.SchDoc: Temperature Sensor
size A4; CheckedBy: rrodrigu; Author: Satxo; CompanyName: Satxo; Revision: 0v1; SheetNumber: 6; SheetTotal: 8; ProjectName: Basestation
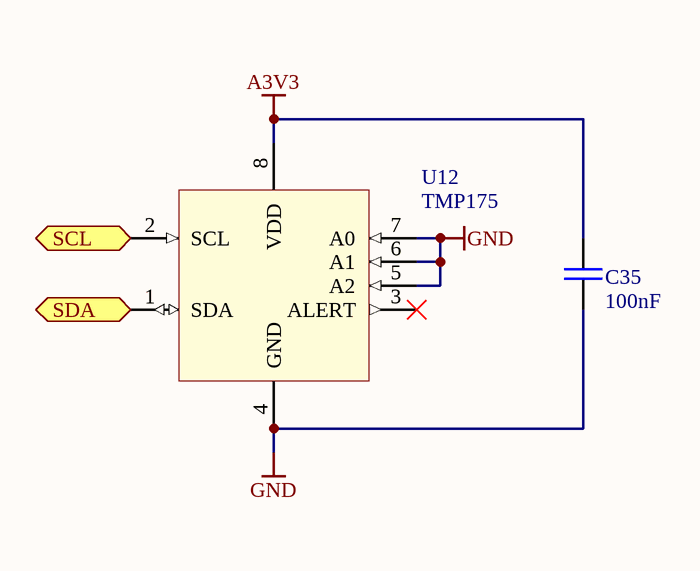
[diagram p5: temperature.SchDoc]

### Parts
C35  100nF  [0603]
U12  TMP175  [SOIC-8]

### Ports
SCL (in), SDA (bidir)

### Nets
A3V3: C35.2 U12.8(VDD)
GND: C35.1 U12.4(GND) U12.5(A2) U12.6(A1) U12.7(A0)
SCL: U12.2(SCL) ; port SCL
SDA: U12.1(SDA) ; port SDA

Not connected (* = marked no-connect by the designer): U12 3(ALERT)*

### Notes on the sheet
- Title
- Size:
- Date:
- A4
- Number:
- Time:
- Revision:
- Sheet
- of
- File:

### Library data of the parts
C35 = CAP: as C1#1 on sheet atmega128rf; Maximum Voltage: *; Creation Date: 2005-04-28; Status: Valid; Validation date: 2006-05-15; Type: Capacitor
U12 = TMP175: Digital Temperature Sensor; Type: IC; Creation Date: 2012-03-05

## Sheet uv.SchDoc: UV Sensor
size A4; CheckedBy: rrodrigu; Author: Satxo; CompanyName: Satxo; Revision: 0v1; SheetNumber: 7; SheetTotal: 8; ProjectName: Basestation
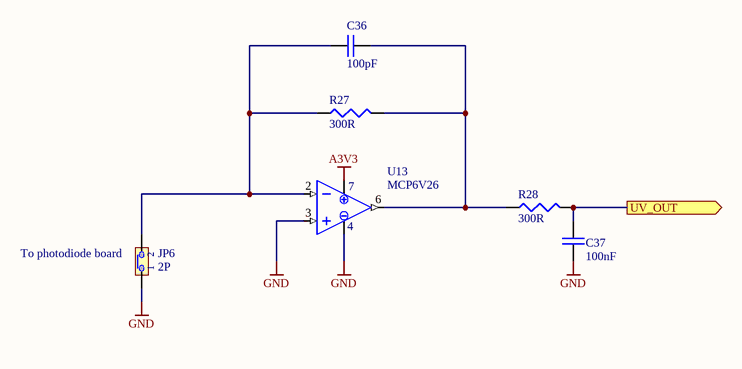
[diagram p6: uv.SchDoc]

### Parts
(Parts that share a designator on the sheet are numbered #1, #2 ... from top to bottom, then left to right.)
C36  100pF  [0603]
C37  100nF  [0603]
JP6  2P  [SIP-2]
R27#1  300R  [0603]
R28#1  300R  [0603]
U13#1  MCP6V26  [SOIC-8]

### Ports
UV_OUT (out)

### Nets
A3V3: U13#1.7(VDD)
GND: C37.1 JP6.1 U13#1.3(INP) U13#1.4(VSS)
UV_OUT: C37.2 R28#1.2 ; port UV_OUT
NetC36_1: C36.1 JP6.2 R27#1.1 U13#1.2(INN)
NetC36_2: C36.2 R27#1.2 R28#1.1 U13#1.6(VOUT)

### Notes on the sheet
- (near JP6) To photodiode board
- Title
- Size:
- Date:
- A4
- Number:
- Time:
- Revision:
- Sheet
- of
- File:

### Library data of the parts
C36 C37 = CAP: as C1#1 on sheet atmega128rf; Maximum Voltage: *; Creation Date: 2005-04-28; Status: Valid; Validation date: 2006-05-15; Type: Capacitor
JP6 = JMP2: as 1 on sheet atmega128rf; Validation Date: 2006-05-15; Creation Date: 2002-07-17; Status: Valid; Type: Electrical & Mechanical
R27#1 R28#1 = RES: as R1#1 on sheet atmega128rf; Validation date: 2006-05-15; Creation Date: 2002-07-17; Status: Valid; Power: *; Type: Resistor
U13#1 = MCP6V26: Low-Offset Opamp; Type: IC; Creation Date: 2012-03-15

## Sheet weatherstation.SchDoc: Weather Station
size A4; CheckedBy: rrodrigu; Author: Satxo; CompanyName: Satxo; Revision: 0v1; SheetNumber: 8; SheetTotal: 8; ProjectName: Basestation
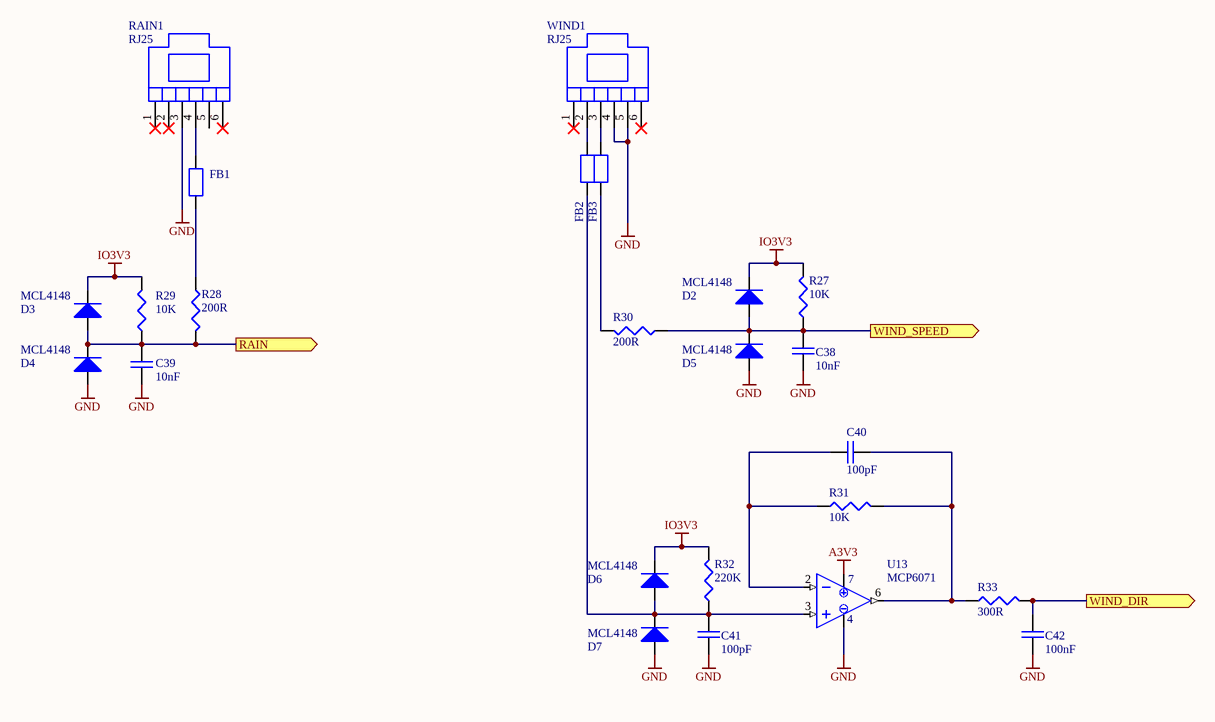
[diagram p7: weatherstation.SchDoc]

### Parts
(Parts that share a designator on the sheet are numbered #1, #2 ... from top to bottom, then left to right.)
C38  10nF  [0603]
C39  10nF  [0603]
C40  100pF  [0603]
C41  100pF  [0603]
C42  100nF  [0603]
D2#2  MCL4148  [0805@DIODE]
D3  MCL4148  [0805@DIODE]
D4  MCL4148  [0805@DIODE]
D5  MCL4148  [0805@DIODE]
D6  MCL4148  [0805@DIODE]
D7  MCL4148  [0805@DIODE]
FB1  150Z_100MHz  [0805]  (value not drawn)
FB2  150Z_100MHz  [0805]  (value not drawn)
FB3  150Z_100MHz  [0805]  (value not drawn)
R27#2  10K  [0603]
R28#2  200R  [0603]
R29  10K  [0603]
R30  200R  [0603]
R31  10K  [0603]
R32  220K  [0603]
R33  300R  [0603]
RAIN1  RJ25  [RJ25]
U13#2  MCP6071  [SOIC-8]
WIND1  RJ25  [RJ25]

### Ports
RAIN (out), WIND_DIR (out), WIND_SPEED (out)

### Nets
A3V3: U13#2.7(VDD)
GND: C38.1 C39.1 C41.1 C42.1 D4.A D5.A D7.A RAIN1.3 U13#2.4(VSS) WIND1.4 WIND1.5
IO3V3: D2#2.K D3.K D6.K R27#2.2 R29.2 R32.2
RAIN: C39.2 D3.A D4.K R28#2.2 R29.1 ; port RAIN
WIND_DIR: C42.2 R33.2 ; port WIND_DIR
WIND_SPEED: C38.2 D2#2.A D5.K R27#2.1 R30.1 ; port WIND_SPEED
NetC40_1: C40.1 R31.1 U13#2.2(INN)
NetC40_2: C40.2 R31.2 R33.1 U13#2.6(VOUT)
NetC41_2: C41.2 D6.A D7.K FB2.2 R32.1 U13#2.3(INP)
NetFB1_1: FB1.1 R28#2.1
NetFB1_2: FB1.2 RAIN1.4
NetFB2_1: FB2.1 WIND1.2
NetFB3_1: FB3.1 WIND1.3
NetFB3_2: FB3.2 R30.2

Not connected (* = marked no-connect by the designer): RAIN1 1* 2* 5 6*; WIND1 1* 6*

### Notes on the sheet
- Title
- Size:
- Date:
- A4
- Number:
- Time:
- Revision:
- Sheet
- of
- File:

### Library data of the parts
C38-C42 = CAP: as C1#1 on sheet atmega128rf; Maximum Voltage: *; Creation Date: 2005-04-28; Status: Valid; Validation date: 2006-05-15; Type: Capacitor
D2#2 D3-D7 = Diode: as D2#1 on sheet power; Validation date: 2006-05-15; Creation Date: 2001-06-05; Status: Valid; Model: MCL4148; Type: Diode
FB1-FB3 = FERRITE-BEAD-AXIAL: Ferrite bead; Sub-Type: Filter; Owner: Sergio Pires; Type: Electrical & Mechanical; Assembly: INS; Creation Date: 2005-10-20; Status: New
R27#2 R28#2 R29-R33 = RES: as R1#1 on sheet atmega128rf; Validation date: 2006-05-15; Creation Date: 2002-07-17; Status: Valid; Power: *; Type: Resistor
RAIN1 WIND1 = RJ25: RJ25 Connector; Type: Connector; Creation Date: 2012-03-26
U13#2 = MCP6V26: Low-Offset Opamp; Type: IC; Creation Date: 2012-03-15

## Nets that join several sheets
A3V3: atmega128rf (C5#1.1 U1#1.1), humidity (8 pins), power (JP3.2 R8#2.2), pressure (C33.2 C34.2 U11.14 U11.15), temperature (C35.2 U12.8), uv (U13#1.7), weatherstation (U13#2.7)
D3V3: atmega128rf (18 pins), power (C1#2.1 JP2.2 R4#2.2)
GND: atmega128rf (45 pins), humidity (10 pins), power (18 pins), pressure (7 pins), temperature (5 pins), uv (C37.1 JP6.1 U13#1.3 U13#1.4), weatherstation (11 pins)
IO3V3: power (JP4.2 R10.2), pressure (U11.1 U11.7 U11.8), weatherstation (6 pins)
VBAT: atmega128rf (1.2 USB_PWR1.2), power (12 pins)
1WIRE: atmega128rf (U2#1.32), humidity (U10.2)
EN_AVDD: atmega128rf (U2#1.42), power (U2#2.3 U3.3)
HIH_OUT: atmega128rf (U2#1.3), humidity (C29.2 R25.2)
PV_OUT: atmega128rf (U2#1.64), power (C4#2.2 Q1#2.S R5#2.2)
RAIN: atmega128rf (U2#1.51), weatherstation (5 pins)
READ_VIN: atmega128rf (U2#1.43), power (Q1#2.G Q2#2.G)
SCL: atmega128rf (R5#1.1 SCL1.1 U2#1.25), humidity (U?.3), pressure (U11.4), temperature (U12.2)
SDA: atmega128rf (R7#1.1 SDA1.1 U2#1.26), humidity (U?.2), pressure (U11.6), temperature (U12.1)
UV_OUT: atmega128rf (U2#1.1), uv (C37.2 R28#1.2)
VBAT_OUT: atmega128rf (U2#1.63), power (C7#2.2 Q2#2.S R9#2.2)
WIND_DIR: atmega128rf (U2#1.2), weatherstation (C42.2 R33.2)
WIND_SPEED: atmega128rf (U2#1.50), weatherstation (5 pins)